# Altium project Adapter-Bodensensoren.PrjPCB
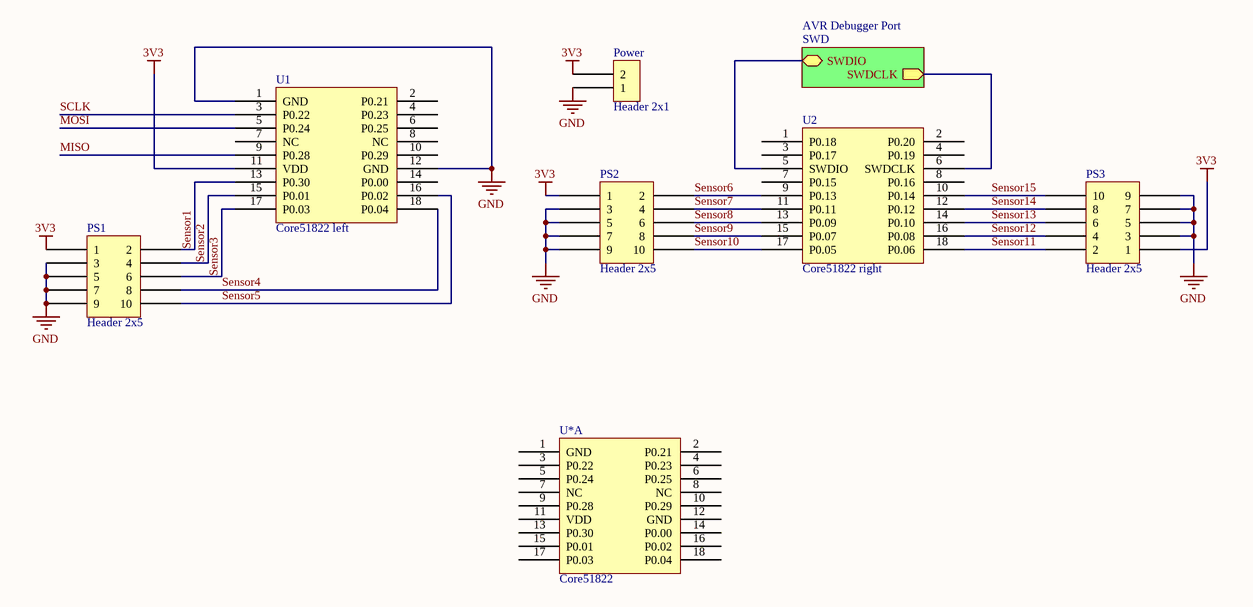
[diagram p0: Top.SchDoc]
2 sheets, 10 parts. Net scope: hierarchical (ports join the sheet entries above them; power ports are global).
Board files: Adapter TH.PcbDoc, Adapter SMD.PcbDoc, Adapter SMD Multi-Nutzen.PcbDoc
Sheets:
  Top.SchDoc
    AVR Debugger Port = SWD.SchDoc

## Sheet Top.SchDoc
size A4

### Parts
Power  Header 2x1  [Screw terminal 2 pin RM 5mm]
PS1  Header 2x5  [Header 2x5 IDC SMT]
PS2  Header 2x5  [Header 2x5 IDC SMT]
PS3  Header 2x5  [Header 2x5 IDC SMT]
U1  Core51822 left  [Header 2.00 2x9 SMD]
U2  Core51822 right  [Header 2.00 2x9 SMD]
U*  Core51822  [Core51822 Layout]  (part A of 2)

### Sub-sheets
AVR Debugger Port = SWD: SWDIO (bidir), SWDCLK (out)

### Nets
3V3: Power.2 PS1.1 PS2.1 PS3.1 U1.11(VDD)
GND: Power.1 PS1.3 PS1.5 PS1.7 PS1.9 PS2.3 PS2.5 PS2.7 PS2.9 PS3.3 PS3.5 PS3.7 PS3.9 U1.1(GND) U1.12(GND)
MISO: U1.9(P0.28)
MOSI: U1.5(P0.24)
SCLK: U1.3(P0.22)
Sensor1: PS1.2 U1.13(P0.30)
Sensor2: PS1.4 U1.15(P0.01)
Sensor3: PS1.6 U1.17(P0.03)
Sensor4: PS1.8 U1.18(P0.04)
Sensor5: PS1.10 U1.16(P0.02)
Sensor6: PS2.2 U2.9(P0.13)
Sensor7: PS2.4 U2.11(P0.11)
Sensor8: PS2.6 U2.13(P0.09)
Sensor9: PS2.8 U2.15(P0.07)
Sensor10: PS2.10 U2.17(P0.05)
Sensor11: PS3.2 U2.18(P0.06)
Sensor12: PS3.4 U2.16(P0.08)
Sensor13: PS3.6 U2.14(P0.10)
Sensor14: PS3.8 U2.12(P0.12)
Sensor15: PS3.10 U2.10(P0.14)
SWDCLK: U2.6(SWDCLK) ; sheet AVR Debugger Port/SWDCLK
SWDIO: U2.5(SWDIO) ; sheet AVR Debugger Port/SWDIO

Not connected (* = marked no-connect by the designer): U1 2(P0.21) 4(P0.23) 6(P0.25) 7(NC) 8(NC) 10(P0.29) 14(P0.00); U2 1(P0.18) 2(P0.20) 3(P0.17) 4(P0.19) 7(P0.15) 8(P0.16); U* 1(GND) 2(P0.21) 3(P0.22) 4(P0.23) 5(P0.24) 6(P0.25) 7(NC) 8(NC) 9(P0.28) 10(P0.29) 11(VDD) 12(GND) 13(P0.30) 14(P0.00) 15(P0.01) 16(P0.02) 17(P0.03) 18(P0.04)

## Sheet SWD.SchDoc
size A4
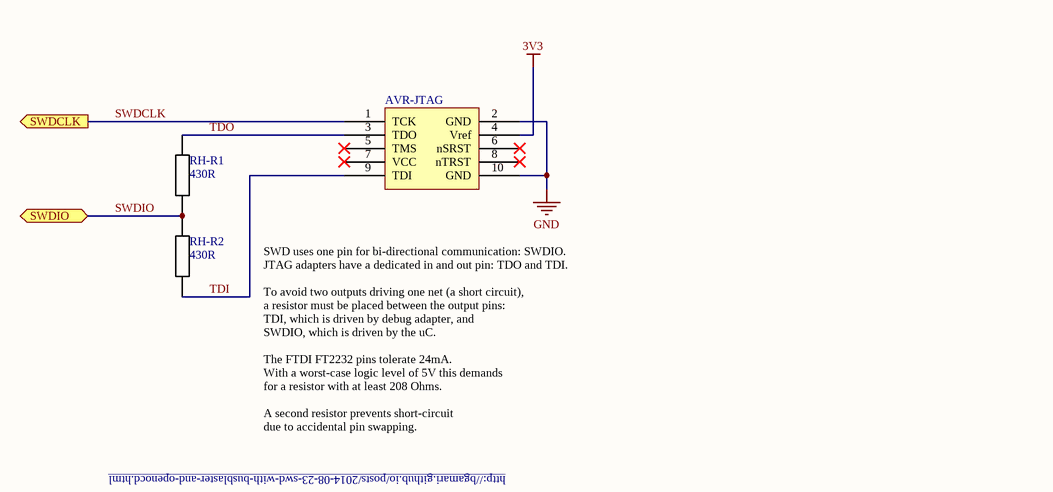
[diagram p1: SWD.SchDoc]

### Parts
AVR-JTAG  AVR Style  [Header 2x5 IDC SMT]  (value not drawn)
RH-R1  430R  [R 0805 / 2012 wide]
RH-R2  430R  [R 0805 / 2012 wide]

### Ports
SWDCLK (out), SWDIO (bidir)

### Nets
3V3: AVR-JTAG.4(Vref)
GND: AVR-JTAG.2(GND) AVR-JTAG.10(GND)
SWDCLK: AVR-JTAG.1(TCK) ; port SWDCLK
SWDIO: RH-R1.1 RH-R2.2 ; port SWDIO
TDI: AVR-JTAG.9(TDI) RH-R2.1
TDO: AVR-JTAG.3(TDO) RH-R1.2

Not connected (* = marked no-connect by the designer): AVR-JTAG 5(TMS)* 6(nSRST)* 7(VCC)* 8(nTRST)*

### Notes on the sheet
- SWD uses one pin for bi-directional communication: SWDIO.
  JTAG adapters have a dedicated in and out pin: TDO and TDI.
  To avoid two outputs driving one net (a short circuit),
  a resistor must be placed between the output pins:
  TDI, which is driven by debug adapter, and
  SWDIO, which is driven by the uC.
  The FTDI FT2232 pins tolerate 24mA.
  With a worst-case logic level of 5V this demands
  for a resistor with at least 208 Ohms.
  A second resistor prevents short-circuit
  due to accidental pin swapping.
- http://bgamari.github.io/posts/2014-08-23-swd-with-busblaster-and-openocd.html

### Library data of the parts
AVR-JTAG = Header JTAG AVR
RH-R1 RH-R2 = Resistor

## Nets that join several sheets
3V3: Top (5 pins), SWD (AVR-JTAG.4)
GND: Top (15 pins), SWD (AVR-JTAG.2 AVR-JTAG.10)
SWDCLK: Top (U2.6), SWD (AVR-JTAG.1)
SWDIO: Top (U2.5), SWD (RH-R1.1 RH-R2.2)